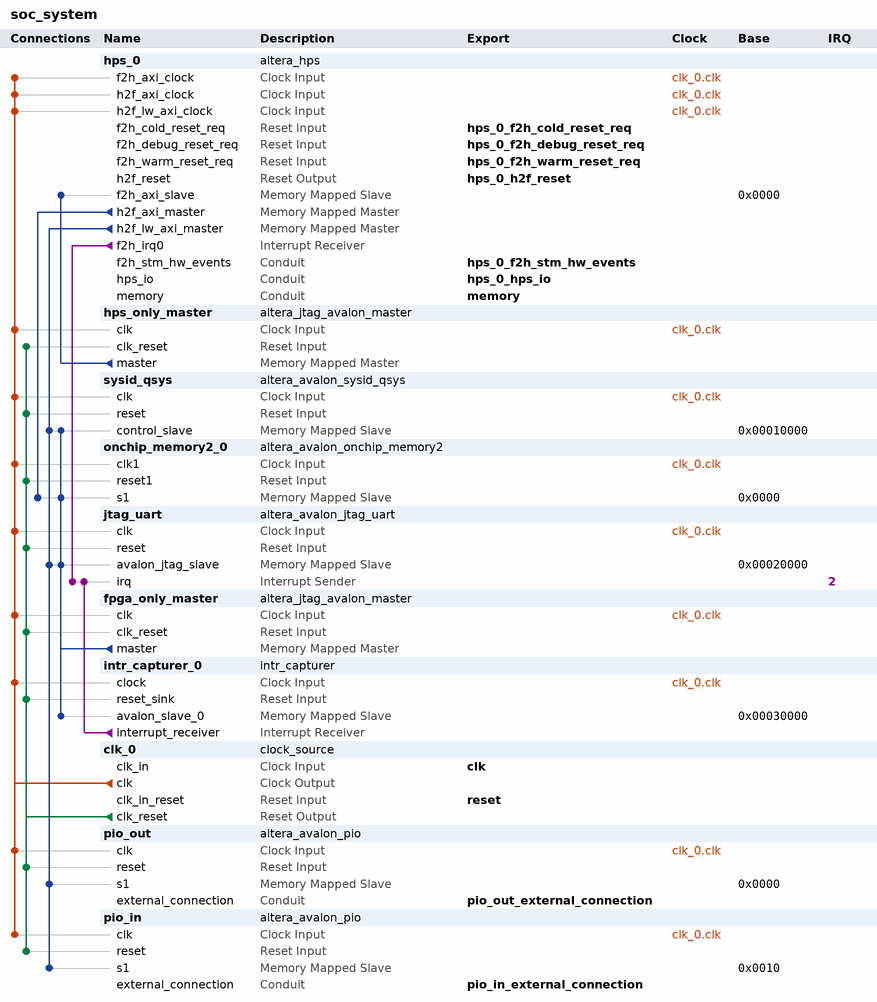
[diagram p0: system contents]
# Platform Designer (Qsys) system soc_system, Cyclone V 5CSEMA5F31C6
# Parameters at their usual value, and those the tool derives, are not listed.
package require -exact qsys 23.1
create_system soc_system
set_project_property DEVICE_FAMILY {Cyclone V}
set_project_property DEVICE 5CSEMA5F31C6

add_instance hps_0 altera_hps 23.1
set_instance_parameter_value hps_0 EMAC1_Mode RGMII
set_instance_parameter_value hps_0 EMAC1_PinMuxing {HPS I/O Set 0}
set_instance_parameter_value hps_0 F2SCLK_COLDRST_Enable true
set_instance_parameter_value hps_0 F2SCLK_DBGRST_Enable true
set_instance_parameter_value hps_0 F2SCLK_WARMRST_Enable true
set_instance_parameter_value hps_0 F2SINTERRUPT_Enable true
set_instance_parameter_value hps_0 F2S_Width 2
set_instance_parameter_value hps_0 FPGA_PERIPHERAL_OUTPUT_CLOCK_FREQ_EMAC0_GTX_CLK 100
set_instance_parameter_value hps_0 FPGA_PERIPHERAL_OUTPUT_CLOCK_FREQ_EMAC0_MD_CLK 100.0
set_instance_parameter_value hps_0 FPGA_PERIPHERAL_OUTPUT_CLOCK_FREQ_EMAC1_GTX_CLK 100
set_instance_parameter_value hps_0 FPGA_PERIPHERAL_OUTPUT_CLOCK_FREQ_EMAC1_MD_CLK 100.0
set_instance_parameter_value hps_0 HPS_PROTOCOL DDR3
set_instance_parameter_value hps_0 I2C0_Mode I2C
set_instance_parameter_value hps_0 I2C0_PinMuxing {HPS I/O Set 0}
set_instance_parameter_value hps_0 I2C1_Mode I2C
set_instance_parameter_value hps_0 I2C1_PinMuxing {HPS I/O Set 0}
set_instance_parameter_value hps_0 LWH2F_Enable true
set_instance_parameter_value hps_0 MEM_BANKADDR_WIDTH 3
set_instance_parameter_value hps_0 MEM_CLK_FREQ 400.0
set_instance_parameter_value hps_0 MEM_COL_ADDR_WIDTH 10
set_instance_parameter_value hps_0 MEM_DQ_WIDTH 32
set_instance_parameter_value hps_0 MEM_DRV_STR RZQ/7
set_instance_parameter_value hps_0 MEM_ROW_ADDR_WIDTH 15
set_instance_parameter_value hps_0 MEM_RTT_NOM RZQ/4
set_instance_parameter_value hps_0 MEM_RTT_WR RZQ/4
set_instance_parameter_value hps_0 MEM_TCL 11
set_instance_parameter_value hps_0 MEM_TFAW_NS 30.0
set_instance_parameter_value hps_0 MEM_TRAS_NS 35.0
set_instance_parameter_value hps_0 MEM_TRCD_NS 13.75
set_instance_parameter_value hps_0 MEM_TRFC_NS 260.0
set_instance_parameter_value hps_0 MEM_TRP_NS 13.75
set_instance_parameter_value hps_0 MEM_VENDOR JEDEC
set_instance_parameter_value hps_0 MEM_WTCL 8
set_instance_parameter_value hps_0 QSPI_Mode {1 SS}
set_instance_parameter_value hps_0 QSPI_PinMuxing {HPS I/O Set 0}
set_instance_parameter_value hps_0 REF_CLK_FREQ 25.0
set_instance_parameter_value hps_0 S2FCLK_USER2CLK 5
set_instance_parameter_value hps_0 S2F_Width 2
set_instance_parameter_value hps_0 SDIO_Mode {4-bit Data}
set_instance_parameter_value hps_0 SDIO_PinMuxing {HPS I/O Set 0}
set_instance_parameter_value hps_0 SPIM1_Mode {Single Slave Select}
set_instance_parameter_value hps_0 SPIM1_PinMuxing {HPS I/O Set 0}
set_instance_parameter_value hps_0 STM_Enable true
set_instance_parameter_value hps_0 TIMING_BOARD_AC_SKEW 0.03
set_instance_parameter_value hps_0 TIMING_BOARD_AC_TO_CK_SKEW 0.0
set_instance_parameter_value hps_0 TIMING_BOARD_DQ_TO_DQS_SKEW 0.0
set_instance_parameter_value hps_0 TIMING_BOARD_MAX_CK_DELAY 0.03
set_instance_parameter_value hps_0 TIMING_BOARD_MAX_DQS_DELAY 0.02
set_instance_parameter_value hps_0 TIMING_BOARD_SKEW_BETWEEN_DQS 0.08
set_instance_parameter_value hps_0 TIMING_BOARD_SKEW_CKDQS_DIMM_MAX 0.16
set_instance_parameter_value hps_0 TIMING_BOARD_SKEW_CKDQS_DIMM_MIN 0.09
set_instance_parameter_value hps_0 TIMING_BOARD_SKEW_WITHIN_DQS 0.01
set_instance_parameter_value hps_0 TIMING_TDH 65
set_instance_parameter_value hps_0 TIMING_TDQSCK 255
set_instance_parameter_value hps_0 TIMING_TDQSQ 125
set_instance_parameter_value hps_0 TIMING_TDS 30
set_instance_parameter_value hps_0 TIMING_TIH 140
set_instance_parameter_value hps_0 TIMING_TIS 180
set_instance_parameter_value hps_0 TIMING_TQSH 0.4
set_instance_parameter_value hps_0 UART0_Mode {No Flow Control}
set_instance_parameter_value hps_0 UART0_PinMuxing {HPS I/O Set 0}
set_instance_parameter_value hps_0 USB1_Mode SDR
set_instance_parameter_value hps_0 USB1_PinMuxing {HPS I/O Set 0}
set_instance_parameter_value hps_0 desired_cfg_clk_mhz 100.0
set_instance_parameter_value hps_0 desired_qspi_clk_mhz 400.0

add_instance hps_only_master altera_jtag_avalon_master 23.1

add_instance sysid_qsys altera_avalon_sysid_qsys 23.1
set_instance_parameter_value sysid_qsys id -1395322110

add_instance onchip_memory2_0 altera_avalon_onchip_memory2 23.1
set_instance_parameter_value onchip_memory2_0 dataWidth 64
set_instance_parameter_value onchip_memory2_0 dualPort false
set_instance_parameter_value onchip_memory2_0 initMemContent true
set_instance_parameter_value onchip_memory2_0 initializationFileName onchip_memory2_0
set_instance_parameter_value onchip_memory2_0 memorySize 65536

add_instance jtag_uart altera_avalon_jtag_uart 23.1
set_instance_parameter_value jtag_uart allowMultipleConnections true
set_instance_parameter_value jtag_uart simInteractiveOptions INTERACTIVE_ASCII_OUTPUT

add_instance fpga_only_master altera_jtag_avalon_master 23.1

add_instance intr_capturer_0 intr_capturer 100.99.98.97

add_instance clk_0 clock_source 23.1
set_instance_parameter_value clk_0 clockFrequency 50000000

add_instance pio_out altera_avalon_pio 23.1
set_instance_parameter_value pio_out direction Output
set_instance_parameter_value pio_out width 32

add_instance pio_in altera_avalon_pio 23.1
set_instance_parameter_value pio_in direction Input
set_instance_parameter_value pio_in width 32

# connections
add_connection clk_0.clk fpga_only_master.clk clock
add_connection clk_0.clk hps_0.f2h_axi_clock clock
add_connection clk_0.clk hps_0.h2f_axi_clock clock
add_connection clk_0.clk hps_0.h2f_lw_axi_clock clock
add_connection clk_0.clk hps_only_master.clk clock
add_connection clk_0.clk intr_capturer_0.clock clock
add_connection clk_0.clk jtag_uart.clk clock
add_connection clk_0.clk onchip_memory2_0.clk1 clock
add_connection clk_0.clk pio_in.clk clock
add_connection clk_0.clk pio_out.clk clock
add_connection clk_0.clk sysid_qsys.clk clock
add_connection clk_0.clk_reset fpga_only_master.clk_reset reset
add_connection clk_0.clk_reset hps_only_master.clk_reset reset
add_connection clk_0.clk_reset intr_capturer_0.reset_sink reset
add_connection clk_0.clk_reset jtag_uart.reset reset
add_connection clk_0.clk_reset onchip_memory2_0.reset1 reset
add_connection clk_0.clk_reset pio_in.reset reset
add_connection clk_0.clk_reset pio_out.reset reset
add_connection clk_0.clk_reset sysid_qsys.reset reset
add_connection fpga_only_master.master intr_capturer_0.avalon_slave_0 avalon
set_connection_parameter_value fpga_only_master.master/intr_capturer_0.avalon_slave_0 baseAddress 0x00030000
add_connection fpga_only_master.master jtag_uart.avalon_jtag_slave avalon
set_connection_parameter_value fpga_only_master.master/jtag_uart.avalon_jtag_slave baseAddress 0x00020000
add_connection fpga_only_master.master onchip_memory2_0.s1 avalon
set_connection_parameter_value fpga_only_master.master/onchip_memory2_0.s1 baseAddress 0x0000
add_connection fpga_only_master.master sysid_qsys.control_slave avalon
set_connection_parameter_value fpga_only_master.master/sysid_qsys.control_slave baseAddress 0x00010000
add_connection hps_0.h2f_axi_master onchip_memory2_0.s1 avalon
set_connection_parameter_value hps_0.h2f_axi_master/onchip_memory2_0.s1 baseAddress 0x0000
add_connection hps_0.h2f_lw_axi_master jtag_uart.avalon_jtag_slave avalon
set_connection_parameter_value hps_0.h2f_lw_axi_master/jtag_uart.avalon_jtag_slave baseAddress 0x00020000
add_connection hps_0.h2f_lw_axi_master pio_in.s1 avalon
set_connection_parameter_value hps_0.h2f_lw_axi_master/pio_in.s1 baseAddress 0x0010
add_connection hps_0.h2f_lw_axi_master pio_out.s1 avalon
set_connection_parameter_value hps_0.h2f_lw_axi_master/pio_out.s1 baseAddress 0x0000
add_connection hps_0.h2f_lw_axi_master sysid_qsys.control_slave avalon
set_connection_parameter_value hps_0.h2f_lw_axi_master/sysid_qsys.control_slave baseAddress 0x00010000
add_connection hps_only_master.master hps_0.f2h_axi_slave avalon
set_connection_parameter_value hps_only_master.master/hps_0.f2h_axi_slave baseAddress 0x0000
add_connection hps_0.f2h_irq0 jtag_uart.irq interrupt
set_connection_parameter_value hps_0.f2h_irq0/jtag_uart.irq irqNumber 2
add_connection intr_capturer_0.interrupt_receiver jtag_uart.irq interrupt
set_connection_parameter_value intr_capturer_0.interrupt_receiver/jtag_uart.irq irqNumber 2

# exported interfaces
add_interface clk clock sink
set_interface_property clk EXPORT_OF clk_0.clk_in
add_interface hps_0_f2h_cold_reset_req reset sink
set_interface_property hps_0_f2h_cold_reset_req EXPORT_OF hps_0.f2h_cold_reset_req
add_interface hps_0_f2h_debug_reset_req reset sink
set_interface_property hps_0_f2h_debug_reset_req EXPORT_OF hps_0.f2h_debug_reset_req
add_interface hps_0_f2h_stm_hw_events conduit end
set_interface_property hps_0_f2h_stm_hw_events EXPORT_OF hps_0.f2h_stm_hw_events
add_interface hps_0_f2h_warm_reset_req reset sink
set_interface_property hps_0_f2h_warm_reset_req EXPORT_OF hps_0.f2h_warm_reset_req
add_interface hps_0_h2f_reset reset source
set_interface_property hps_0_h2f_reset EXPORT_OF hps_0.h2f_reset
add_interface hps_0_hps_io conduit end
set_interface_property hps_0_hps_io EXPORT_OF hps_0.hps_io
add_interface memory conduit end
set_interface_property memory EXPORT_OF hps_0.memory
add_interface pio_in_external_connection conduit end
set_interface_property pio_in_external_connection EXPORT_OF pio_in.external_connection
add_interface pio_out_external_connection conduit end
set_interface_property pio_out_external_connection EXPORT_OF pio_out.external_connection
add_interface reset reset sink
set_interface_property reset EXPORT_OF clk_0.clk_in_reset

set_interconnect_requirement {$system} qsys_mm.clockCrossingAdapter HANDSHAKE
set_interconnect_requirement {$system} qsys_mm.maxAdditionalLatency 1

save_system soc_system.qsys
